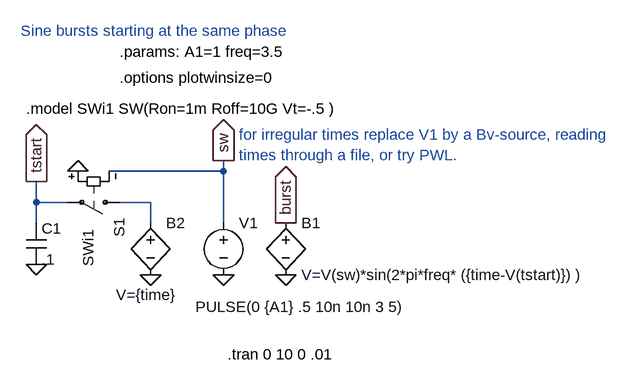
[diagram p0: schematic sine_bursts.asc]
sine_bursts.asc, the LTspice schematic file:
Version 4
SHEET 1 880 680
WIRE -64 224 -64 144
WIRE -304 192 -352 192
WIRE -352 192 -352 224
WIRE -352 160 -352 192
WIRE -224 192 -176 192
WIRE -176 192 -176 224
WIRE -240 144 -64 144
WIRE -64 144 -64 128
FLAG 32 304 0
FLAG 32 224 burst
IOPIN 32 224 Out
FLAG -64 304 0
FLAG -64 128 sw
IOPIN -64 128 Out
FLAG -352 288 0
FLAG -352 160 tstart
IOPIN -352 160 Out
FLAG -176 304 0
FLAG -288 144 0
SYMBOL bv 32 208 R0
SYMATTR InstName B1
SYMATTR Value V=V(sw)*sin(2*pi*freq* ({time-V(tstart)}) )
SYMBOL voltage -64 208 R0
WINDOW 3 -43 145 Left 0
WINDOW 123 0 0 Left 0
WINDOW 39 0 0 Left 0
SYMATTR Value PULSE(0 {A1} .5 10n 10n 3 5)
SYMATTR InstName V1
SYMBOL cap -368 224 R0
SYMATTR InstName C1
SYMATTR Value .1
SYMBOL sw -208 192 R90
WINDOW 3 42 64 Left 0
SYMATTR Value SWi1
SYMATTR InstName S1
SYMBOL bv -176 208 R0
WINDOW 3 -53 127 Left 0
SYMATTR Value V={time}
SYMATTR InstName B2
TEXT -224 -40 Left 0 !.params: A1=1 freq=3.5
TEXT -58 426 Left 0 !.tran 0 10 0 .01
TEXT -224 0 Left 0 !.options plotwinsize=0
TEXT -368 48 Left 0 !.model SWi1 SW(Ron=1m Roff=10G Vt=-.5 )
TEXT -40 88 Left 0 ;for irregular times replace V1 by a Bv-source, reading\ntimes through a file, or try PWL.
TEXT -376 -72 Left 0 ;Sine bursts starting at the same phase

The netlist it stands for:
* sine_bursts.asc
B1 burst 0 V=V(sw)*sin(2*pi*freq* ({time-V(tstart)}) )
V1 sw 0 PULSE(0 {A1} .5 10n 10n 3 5)
C1 tstart 0 .1
S1 N001 tstart 0 sw SWi1
B2 N001 0 V={time}
.params: A1=1 freq=3.5
.tran 0 10 0 .01
.options plotwinsize=0
.model SWi1 SW(Ron=1m Roff=10G Vt=-.5 )
* for irregular times replace V1 by a Bv-source, reading
* times through a file, or try PWL.
* Sine bursts starting at the same phase
.backanno
.end